# Altium schematic sheet CPU_DDR.SchDoc
size A4; SheetNumber: 3; SheetTotal: 6
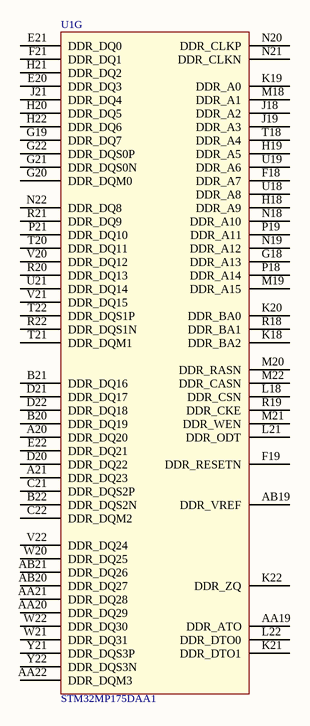
[diagram p0: CPU_DDR.SchDoc]

## Parts
U1  STM32MP175DAA1  [LFBGA448]  (part G of 7)

## Nets

Not connected (* = marked no-connect by the designer): U1 A20(DDR_DQ20) A21(DDR_DQ23) AA19(DDR_ATO) AA20(DDR_DQ29) AA21(DDR_DQ28) AA22(DDR_DQM3) AB19(DDR_VREF) AB20(DDR_DQ27) AB21(DDR_DQ26) B20(DDR_DQ19) B21(DDR_DQ16) B22(DDR_DQS2N) C21(DDR_DQS2P) C22(DDR_DQM2) D20(DDR_DQ22) D21(DDR_DQ17) D22(DDR_DQ18) E20(DDR_DQ3) E21(DDR_DQ0) E22(DDR_DQ21) F18(DDR_A7) F19(DDR_RESETN) F21(DDR_DQ1) G18(DDR_A13) G19(DDR_DQ7) G20(DDR_DQM0) G21(DDR_DQS0N) G22(DDR_DQS0P) H18(DDR_A9) H19(DDR_A5) H20(DDR_DQ5) H21(DDR_DQ2) H22(DDR_DQ6) J18(DDR_A2) J19(DDR_A3) J21(DDR_DQ4) K18(DDR_BA2) K19(DDR_A0) K20(DDR_BA0) K21(DDR_DTO1) K22(DDR_ZQ) L18(DDR_CSN) L21(DDR_ODT) L22(DDR_DTO0) M18(DDR_A1) M19(DDR_A15) M20(DDR_RASN) M21(DDR_WEN) M22(DDR_CASN) N18(DDR_A10) N19(DDR_A12) N20(DDR_CLKP) N21(DDR_CLKN) N22(DDR_DQ8) P18(DDR_A14) P19(DDR_A11) P21(DDR_DQ10) R18(DDR_BA1) R19(DDR_CKE) R20(DDR_DQ13) R21(DDR_DQ9) R22(DDR_DQS1N) T18(DDR_A4) T20(DDR_DQ11) T21(DDR_DQM1) T22(DDR_DQS1P) U18(DDR_A8) U19(DDR_A6) U21(DDR_DQ14) V20(DDR_DQ12) V21(DDR_DQ15) V22(DDR_DQ24) W20(DDR_DQ25) W21(DDR_DQ31) W22(DDR_DQ30) Y21(DDR_DQS3P) Y22(DDR_DQS3N)

## Library data of the parts
U1 = STM32MP175AAA3